# Altium schematic sheet 全场定位.SchDoc
size A4
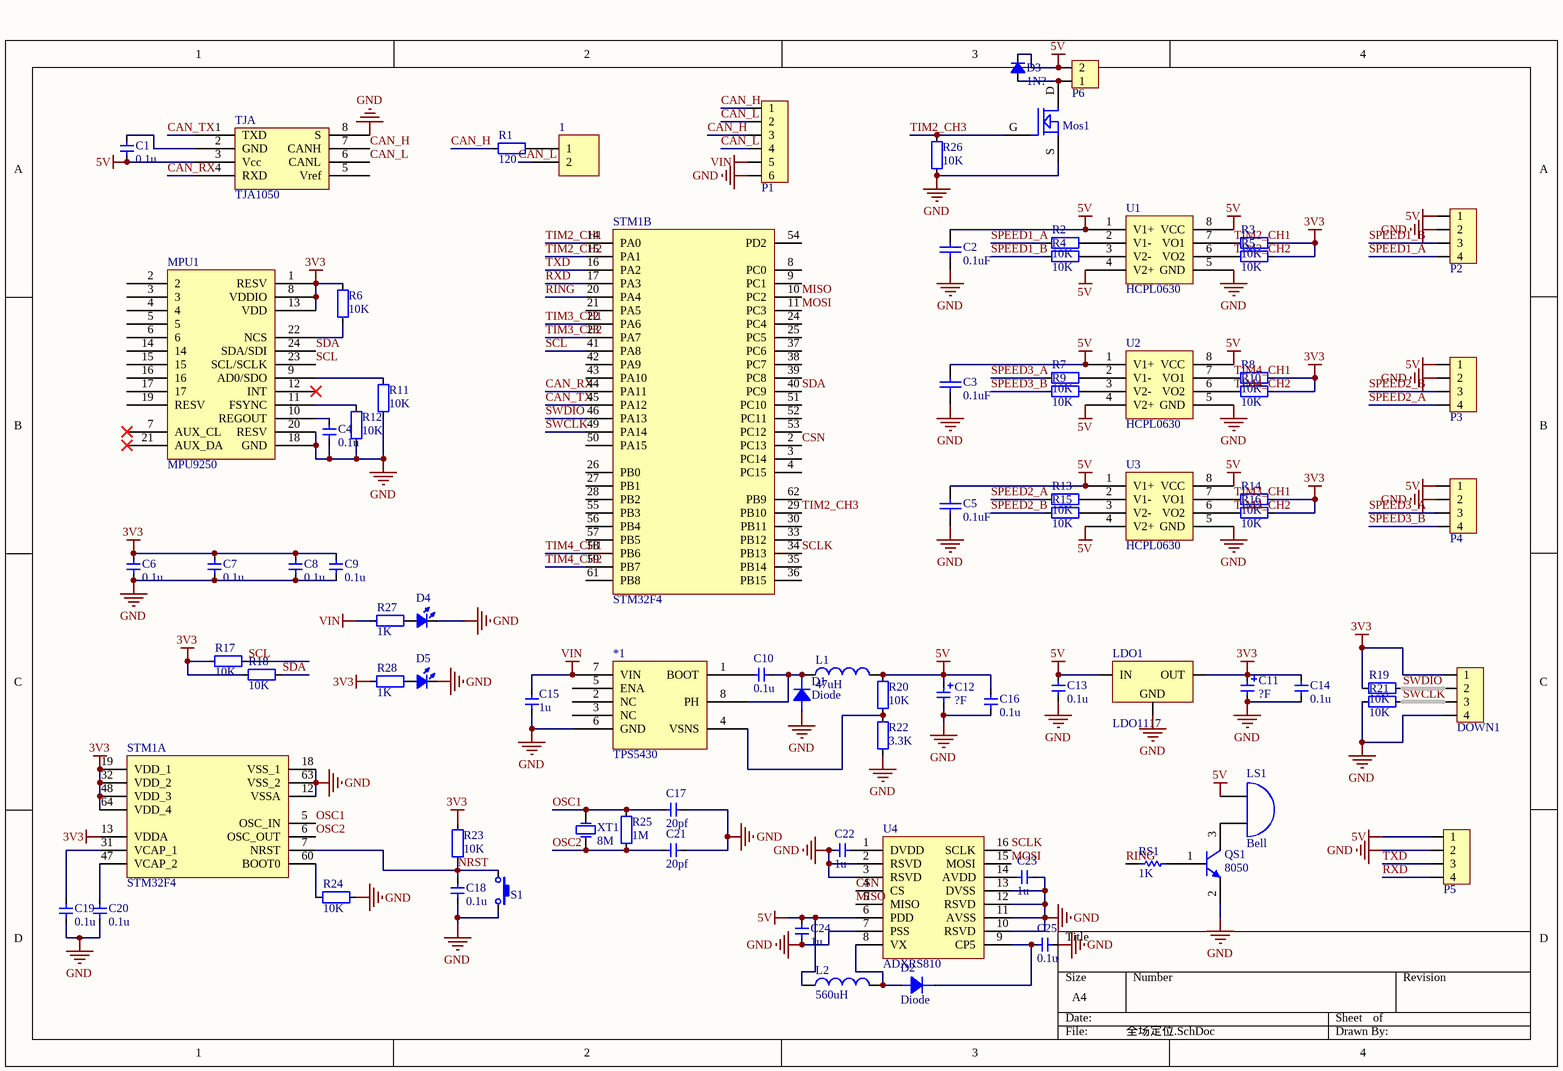
[diagram p0: 全场定位.SchDoc]

## Parts
1  Header 2  [SIP2]  (value not drawn)
*1  TPS5430  [SOP_E150_8]
C1  value 0.1u  [CAP_0603]  (hidden comment: Cap_0603)
C2  value 0.1uF  [CAP-MLCC-0603]  (hidden comment: Cap)
C3  value 0.1uF  [CAP-MLCC-0603]  (hidden comment: Cap)
C4  value 0.1u  [CAP_0603]  (hidden comment: Cap_0603)
C5  value 0.1uF  [CAP-MLCC-0603]  (hidden comment: Cap)
C6  value 0.1u  [CAP_0603]  (hidden comment: Cap_0603)
C7  value 0.1u  [CAP_0603]  (hidden comment: Cap_0603)
C8  value 0.1u  [CAP_0603]  (hidden comment: Cap_0603)
C9  value 0.1u  [CAP_0603]  (hidden comment: Cap_0603)
C10  value 0.1u  [CAP_0603]  (hidden comment: Cap_0603)
C11  value ?F  [CAP_TAN_A1206]  (hidden comment: Cap_Tan_1206)
C12  value ?F  [CAP_TAN_A1206]  (hidden comment: Cap_Tan_1206)
C13  value 0.1u  [CAP_0603]  (hidden comment: Cap_0603)
C14  value 0.1u  [CAP_0603]  (hidden comment: Cap_0603)
C15  value 1u  [CAP_0603]  (hidden comment: Cap_0603)
C16  value 0.1u  [CAP_0603]  (hidden comment: Cap_0603)
C17  value 20pf  [CAP_0603]  (hidden comment: Cap_0603)
C18  value 0.1u  [CAP_0603]  (hidden comment: Cap_0603)
C19  value 0.1u  [CAP_0603]  (hidden comment: Cap_0603)
C20  value 0.1u  [CAP_0603]  (hidden comment: Cap_0603)
C21  value 20pf  [CAP_0603]  (hidden comment: Cap_0603)
C22  value 1u  [CAP_0603]  (hidden comment: Cap_0603)
C23  value 1u  [CAP_0603]  (hidden comment: Cap_0603)
C24  value 1u  [CAP_0603]  (hidden comment: Cap_0603)
C25  value 0.1u  [CAP_0603]  (hidden comment: Cap_0603)
D1  Diode  [SS34]
D2  Diode  [SS34]
D3  value 1N?  [DO-214AC]  (hidden comment: Diode_SMA)
D4  LED_0805  [LED_0805_YELLOW]  (value not drawn)
D5  LED_0805  [LED_0805_YELLOW]  (value not drawn)
DOWN1  HDR1x4_2.54  [HDR1X4_2.54_180]  (value not drawn)
L1  value 47uH  [CD74]  (hidden comment: Inductor)
L2  value 560uH  [CD74]  (hidden comment: Inductor)
LDO1  LDO1117  [SOT223-3]
LS1  Bell  [Ring]
Mos1  MOSFET N  [Nmos_SOT23]  (value not drawn)
MPU1  MPU9250  [QFN_P0.4_24]
P1  HDR1x6_2.54  [green_6p]  (value not drawn)
P2  HDR1x4_2.54  [Green_4P]  (value not drawn)
P3  HDR1x4_2.54  [green_4p]  (value not drawn)
P4  HDR1x4_2.54  [green_4p]  (value not drawn)
P5  HDR1x4_2.54  [HDR1X4_2.54_180]  (value not drawn)
P6  Connector  [Green 2P]  (value not drawn)
QS1  8050  [SOT-23B_N]
R1  value 120  [RES_0603]  (hidden comment: Res_0603)
R2  value 10K  [RES_0603]  (hidden comment: Res_0603)
R3  value 10K  [RES_0603]  (hidden comment: Res_0603)
R4  value 10K  [RES_0603]  (hidden comment: Res_0603)
R5  value 10K  [RES_0603]  (hidden comment: Res_0603)
R6  value 10K  [RES_0603]  (hidden comment: Res_0603)
R7  value 10K  [RES_0603]  (hidden comment: Res_0603)
R8  value 10K  [RES_0603]  (hidden comment: Res_0603)
R9  value 10K  [RES_0603]  (hidden comment: Res_0603)
R10  value 10K  [RES_0603]  (hidden comment: Res_0603)
R11  value 10K  [RES_0603]  (hidden comment: Res_0603)
R12  value 10K  [RES_0603]  (hidden comment: Res_0603)
R13  value 10K  [RES_0603]  (hidden comment: Res_0603)
R14  value 10K  [RES_0603]  (hidden comment: Res_0603)
R15  value 10K  [RES_0603]  (hidden comment: Res_0603)
R16  value 10K  [RES_0603]  (hidden comment: Res_0603)
R17  value 10K  [RES_0603]  (hidden comment: Res_0603)
R18  value 10K  [RES_0603]  (hidden comment: Res_0603)
R19  value 10K  [RES_0603]  (hidden comment: Res_0603)
R20  value 10K  [RES_0603]  (hidden comment: Res_0603)
R21  value 10K  [RES_0603]  (hidden comment: Res_0603)
R22  value 3.3K  [RES_0603]  (hidden comment: Res_0603)
R23  value 10K  [RES_0603]  (hidden comment: Res_0603)
R24  value 10K  [RES_0603]  (hidden comment: Res_0603)
R25  value 1M  [RES_0603]  (hidden comment: Res_0603)
R26  value 10K  [RES_0603]  (hidden comment: Res_0603)
R27  value 1K  [RES_0603]  (hidden comment: Res_0603)
R28  value 1K  [RES_0603]  (hidden comment: Res_0603)
RS1  value 1K  [RES-0603]  (hidden comment: Res1)
S1  ButtonTACT_3x4x2_180  [ButtonTACT_3x4x2_180H]  (value not drawn)
STM1  STM32F4  [LQFP_P0.5_64]  (parts A,B of 2)
TJA  TJA1050  [SOP_E150_8]
U1  HCPL0630  [SOP_E150_8]
U2  HCPL0630  [SOP_E150_8]
U3  HCPL0630  [SOP_E150_8]
U4  ADXRS810  [sop16]
XT1  value 8M  [XT_5032_2]  (hidden comment: XTAL_5032_2P)

## Nets
3V3: C6.2 C7.2 C8.2 C9.2 C11.1 C14.1 DOWN1.1 LDO1.2(OUT) MPU1.1(RESV) MPU1.8(VDDIO) MPU1.13(VDD) R3.1 R5.1 R6.1 R8.1 R10.1 R14.1 R16.1 R17.2 R18.2 R19.2 R23.1 R28.1 STM1.13(VDDA) STM1.19(VDD_1) STM1.32(VDD_2) STM1.48(VDD_3) STM1.64(VDD_4)
5V: C1.1 C2.1 C3.1 C5.1 C12.1 C13.1 C16.1 C24.1 D3.2(K) L1.2 L2.1 LDO1.3(IN) LS1.1(A) P2.1 P3.1 P4.1 P5.1 P6.2 R20.1 TJA.3(Vcc) U1.1(V1+) U1.4(V2+) U1.8(VCC) U2.1(V1+) U2.4(V2+) U2.8(VCC) U3.1(V1+) U3.4(V2+) U3.8(VCC) U4.6(PDD)
GND: *1.6(GND) C2.2 C3.2 C4.2 C5.2 C6.1 C7.1 C8.1 C9.1 C11.2 C12.2 C13.2 C14.2 C15.1 C16.2 C17.1 C18.1 C19.2 C20.2 C21.1 C22.2 C23.2 C24.2 C25.1 D1.A D4.2(K) D5.2(K) DOWN1.4 LDO1.1(GND) Mos1.S MPU1.18(GND) MPU1.20(RESV) P1.6 P2.2 P3.2 P4.2 P5.2 QS1.2(E) R11.2 R12.2 R21.2 R22.2 R24.2 R26.2 S1.2 STM1.12(VSSA) STM1.18(VSS_1) STM1.63(VSS_2) TJA.8(S) U1.5(GND) U2.5(GND) U3.5(GND) U4.2(RSVD) U4.3(RSVD) U4.7(PSS) U4.10(RSVD) U4.11(AVSS) U4.12(RSVD) U4.13(DVSS)
VIN: *1.7(VIN) C15.2 P1.5 R27.1
CAN_H: P1.1 P1.3 R1.1 TJA.7(CANH)
CAN_L: 1.2 P1.2 P1.4 TJA.6(CANL)
CAN_RX: STM1.44(PA11) TJA.4(RXD)
CAN_TX: STM1.45(PA12) TJA.1(TXD)
CSN: STM1.2(PC13) U4.4(CS)
MISO: STM1.10(PC2) U4.5(MISO)
MOSI: STM1.11(PC3) U4.15(MOSI)
NRST: C18.2 R23.2 S1.1 STM1.7(NRST)
OSC1: C17.2 R25.2 STM1.5(OSC_IN) XT1.2(OSC2)
OSC2: C21.2 R25.1 STM1.6(OSC_OUT) XT1.1(OSC1)
RING: RS1.2 STM1.20(PA4)
RXD: P5.4 STM1.17(PA3)
SCL: MPU1.23(SCL/SCLK) R17.1 STM1.41(PA8)
SCLK: STM1.34(PB13) U4.16(SCLK)
SDA: MPU1.24(SDA/SDI) R18.1 STM1.40(PC9)
SPEED1_A: P2.4 R2.2
SPEED1_B: P2.3 R4.2
SPEED2_A: P3.4 R13.2
SPEED2_B: P3.3 R15.2
SPEED3_A: P4.3 R7.2
SPEED3_B: P4.4 R9.2
SWCLK: DOWN1.3 R21.1 STM1.49(PA14)
SWDIO: DOWN1.2 R19.1 STM1.46(PA13)
TIM2_CH1: R3.2 STM1.14(PA0) U1.7(VO1)
TIM2_CH2: R5.2 STM1.15(PA1) U1.6(VO2)
TIM2_CH3: Mos1.G R26.1 STM1.29(PB10)
TIM3_CH1: R14.2 STM1.22(PA6) U3.7(VO1)
TIM3_CH2: R16.2 STM1.23(PA7) U3.6(VO2)
TIM4_CH1: R8.2 STM1.58(PB6) U2.7(VO1)
TIM4_CH2: R10.2 STM1.59(PB7) U2.6(VO2)
TXD: P5.3 STM1.16(PA2)
Net1_1: 1.1 R1.2
Net*1_1: *1.1(BOOT) C10.2
Net*1_4: *1.4(VSNS) R20.2 R22.1
Net*1_8: *1.8(PH) C10.1 D1.K L1.1
NetC1_2: C1.2 TJA.2(GND)
NetC4_1: C4.1 MPU1.10(REGOUT)
NetC19_1: C19.1 STM1.31(VCAP_1)
NetC20_1: C20.1 STM1.47(VCAP_2)
NetC22_1: C22.1 U4.1(DVDD)
NetC23_1: C23.1 U4.14(AVDD)
NetC25_2: C25.2 D2.K U4.9(CP5)
NetD2_A: D2.A L2.2 U4.8(VX)
NetD3_1: D3.1(A) Mos1.D P6.1
NetD4_1: D4.1(A) R27.2
NetD5_1: D5.1(A) R28.2
NetLS1_2: LS1.2(B) QS1.3(C)
NetMPU1_9: MPU1.9(AD0/SDO) R11.1
NetMPU1_11: MPU1.11(FSYNC) R12.1
NetMPU1_22: MPU1.22(NCS) R6.2
NetQS1_1: QS1.1(B) RS1.1
NetR2_1: R2.1 U1.2(V1-)
NetR4_1: R4.1 U1.3(V2-)
NetR7_1: R7.1 U2.2(V1-)
NetR9_1: R9.1 U2.3(V2-)
NetR13_1: R13.1 U3.2(V1-)
NetR15_1: R15.1 U3.3(V2-)
NetR24_1: R24.1 STM1.60(BOOT0)

Not connected (* = marked no-connect by the designer): *1 2(NC) 3(NC) 5(ENA); MPU1 2 3 4 5 6 7(AUX_CL)* 12(INT)* 14 15 16 17 19(RESV) 21(AUX_DA)*; STM1 3(PC14) 4(PC15) 8(PC0) 9(PC1) 21(PA5) 24(PC4) 25(PC5) 26(PB0) 27(PB1) 28(PB2) 30(PB11) 33(PB12) 35(PB14) 36(PB15) 37(PC6) 38(PC7) 39(PC8) 42(PA9) 43(PA10) 50(PA15) 51(PC10) 52(PC11) 53(PC12) 54(PD2) 55(PB3) 56(PB4) 57(PB5) 61(PB8) 62(PB9); TJA 5(Vref)

## Library data of the parts
1 = Header 2: Header, 2-Pin; LatestRevisionDate: 17-Jul-2002; LatestRevisionNote: Re-released for DXP Platform.; Publisher: Altium Limited
C1 C4 C6-C10 C13-C25 = Cap_0603: Capacitor
C2 C3 C5 = Cap: Capacitor; Published: 8-Jun-2000; LatestRevisionDate: 17-Jul-2002; LatestRevisionNote: Re-released for DXP Platform.; PackageReference: RAD-0.3; Publisher: Altium Limited
C11 C12 = Cap_Tan_1206: Capacitor
D3 = Diode_SMA: Diode
D4 D5 = LED_0805: LED
DOWN1 P2-P5 = HDR1x4_2.54: Header
L1 L2 = Inductor: Code_IEC: 1005; Published: 8-Jun-2000; LatestRevisionDate: 17-Jul-2002; LatestRevisionNote: Re-released for DXP Platform.; PackageReference: 0402-A; Publisher: Altium Limited; Code_JEITA: 0402
LDO1 = LDO1117: Power
LS1 = Bell: Electrical Bell; Published: 24-Mar-1999; LatestRevisionDate: 17-Jul-2002; LatestRevisionNote: Re-released for DXP Platform.; PackageReference: PIN2; Publisher: Altium Limited
Mos1 = MOSFET N: MOS SOT23
P1 = HDR1x6_2.54: Header
P6 = 2P
QS1 = QNPN: NPN Bipolar Transistor; Published: 8-Jun-2000; LatestRevisionDate: 29-May-2009; LatestRevisionNote: IPC-7351 Footprint Added.; PackageVersion: Aug-1999; PackageReference: SOT-23B; Publisher: Altium Limited; PackageDescription: 3-Pin SOT-23 Package 0.95 mm Pitch, 2.4 mm Lead Span
R1-R28 = Res_0603: Resistor
RS1 = Res1: Resistor; Published: 8-Jun-2000; LatestRevisionDate: 17-Jul-2002; LatestRevisionNote: Re-released for DXP Platform.; PackageReference: AXIAL-0.3; Publisher: Altium Limited
S1 = ButtonTACT_3x4x2_180: Button
STM1 = STM32F405R: MCU
XT1 = XTAL_5032_2P: Crystal Oscillator